# Altium schematic sheet COVER PAGE.SchDoc
size A4
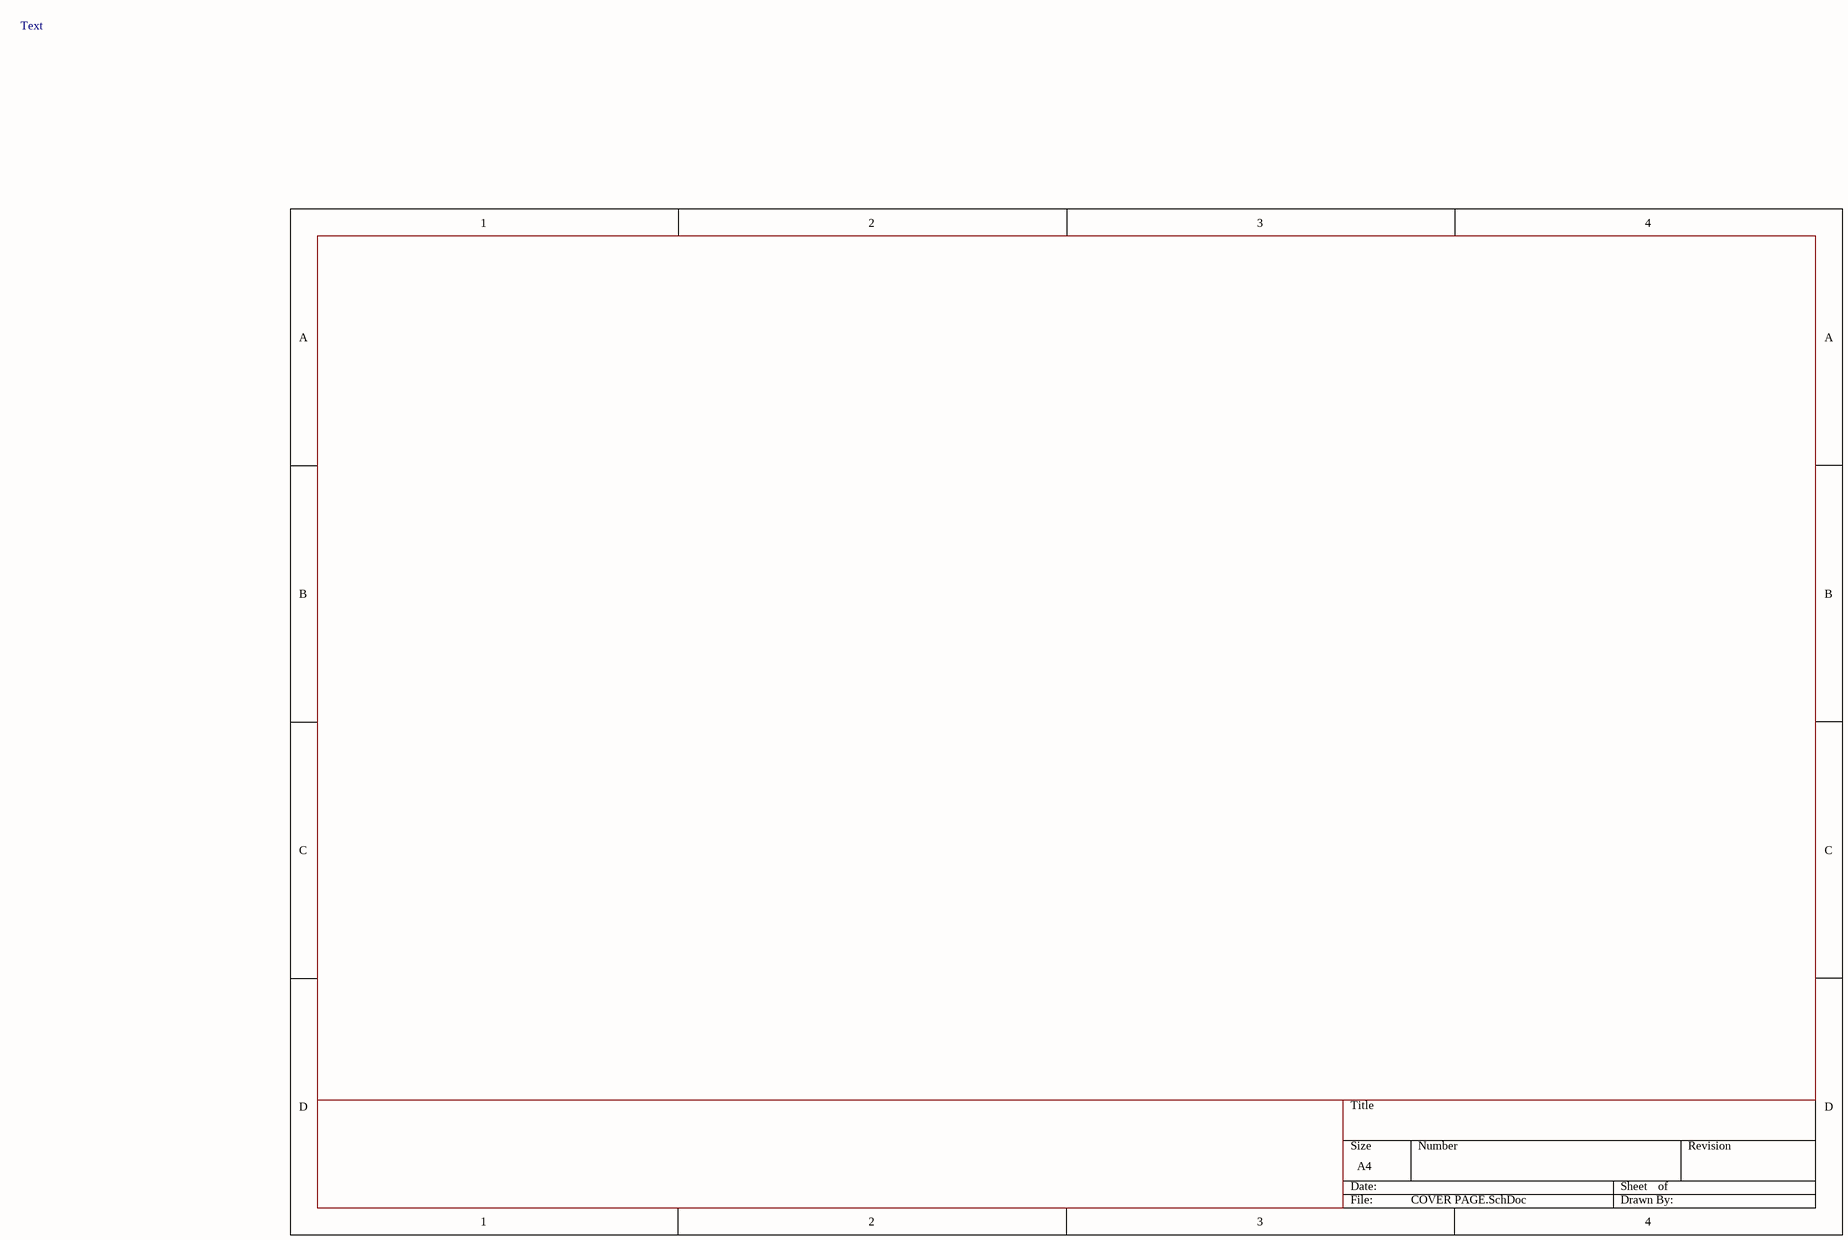
[diagram p0: COVER PAGE.SchDoc]

## Notes on the sheet
- Text